# EAGLE design nedonand5 (EAGLE 5.12)
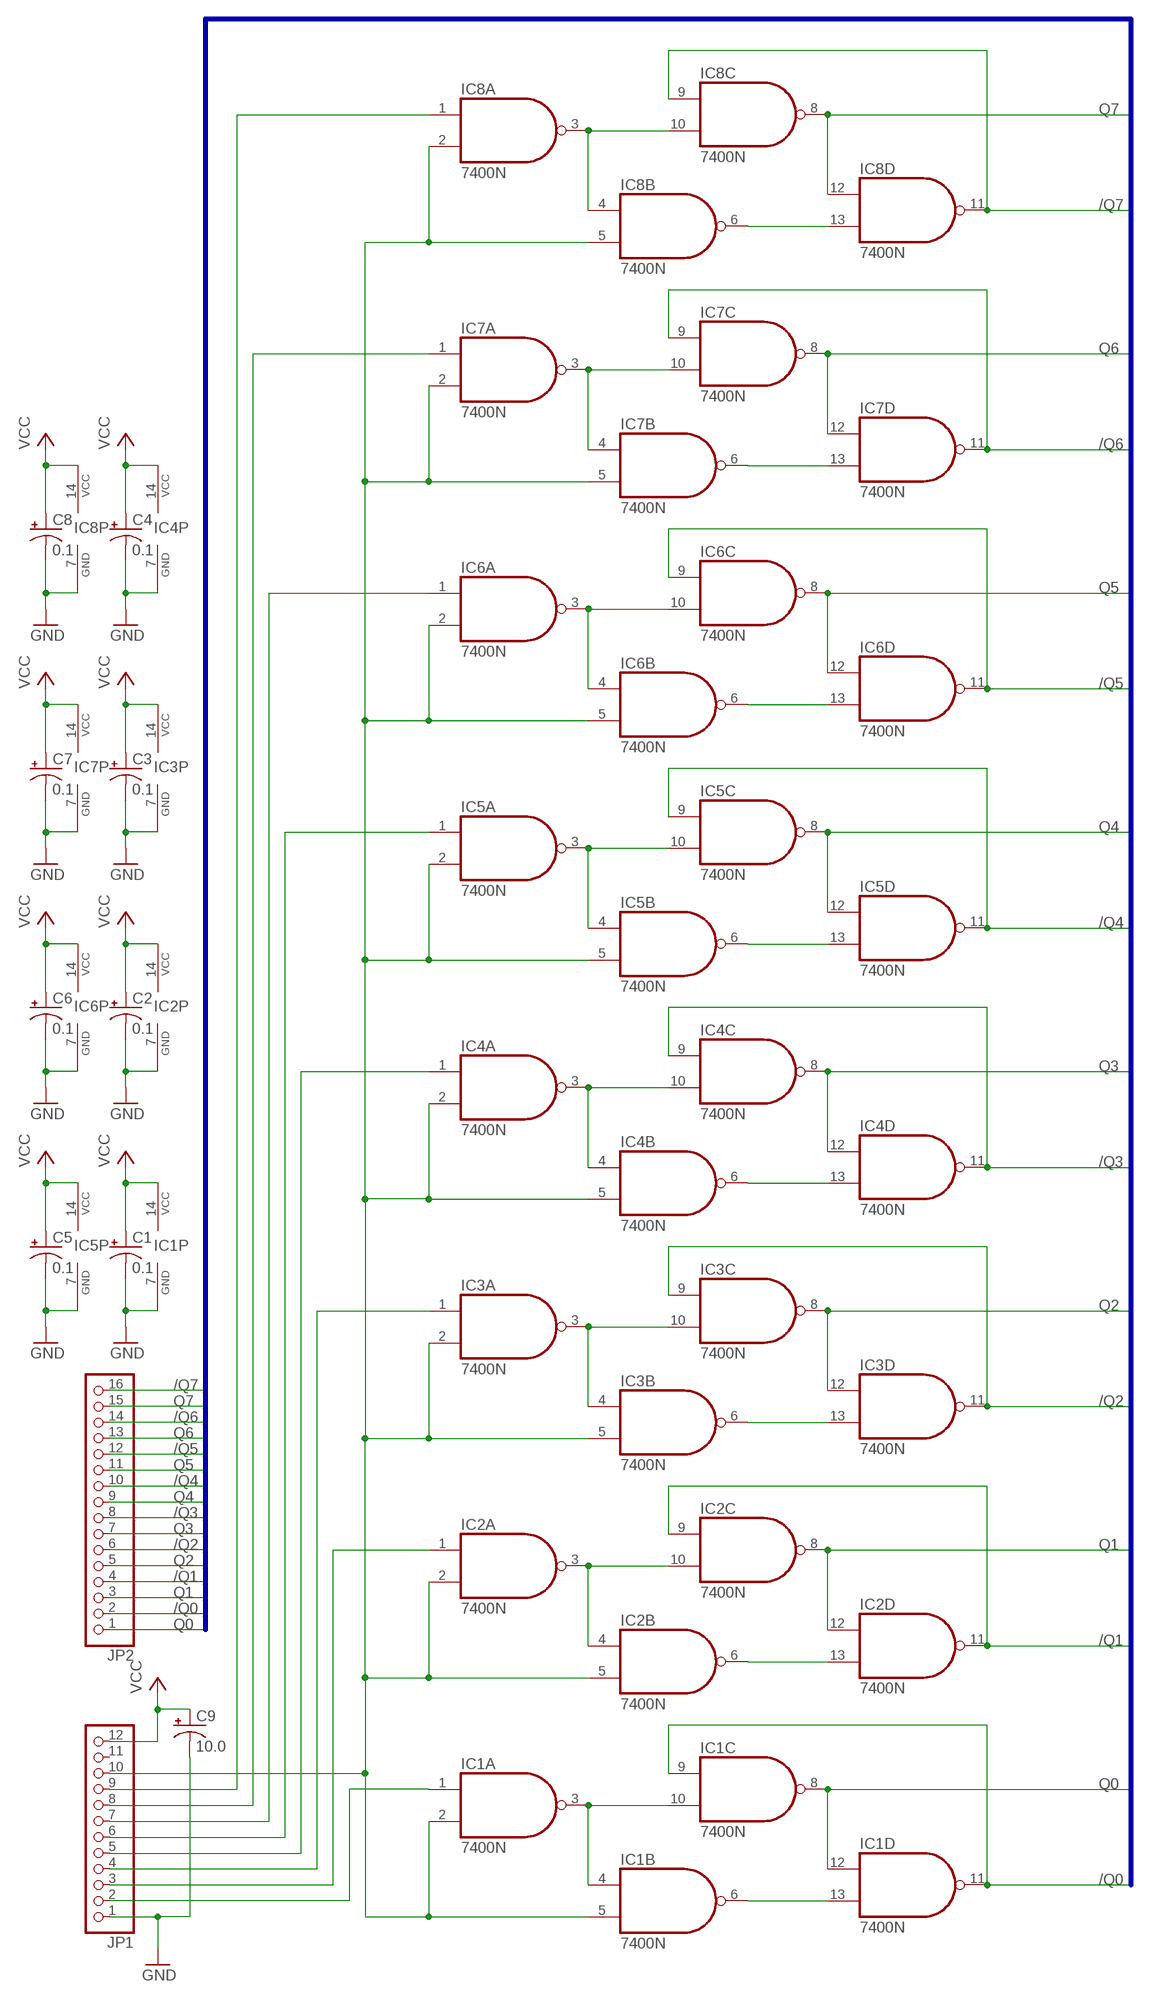
[diagram p0: schematic, sheet 1]

## Parts
C1  0.1  CPOL-USB45181A  [B45181A]
C2  0.1  CPOL-USB45181A  [B45181A]
C3  0.1  CPOL-USB45181A  [B45181A]
C4  0.1  CPOL-USB45181A  [B45181A]
C5  0.1  CPOL-USB45181A  [B45181A]
C6  0.1  CPOL-USB45181A  [B45181A]
C7  0.1  CPOL-USB45181A  [B45181A]
C8  0.1  CPOL-USB45181A  [B45181A]
C9  10.0  CPOL-USE2,5-6E  [E2,5-6E]
IC1  7400N  [DIL14]
IC2  7400N  [DIL14]
IC3  7400N  [DIL14]
IC4  7400N  [DIL14]
IC5  7400N  [DIL14]
IC6  7400N  [DIL14]
IC7  7400N  [DIL14]
IC8  7400N  [DIL14]
JP1  PINHD-1X12/90  [1X12/90]
JP2  PINHD-1X16/90  [1X16/90]

## Nets
/Q0: IC1.9(C:I0) IC1.11(D:O) JP2.2
/Q1: IC2.9(C:I0) IC2.11(D:O) JP2.4
/Q2: IC3.9(C:I0) IC3.11(D:O) JP2.6
/Q3: IC4.9(C:I0) IC4.11(D:O) JP2.8
/Q4: IC5.9(C:I0) IC5.11(D:O) JP2.10
/Q5: IC6.9(C:I0) IC6.11(D:O) JP2.12
/Q6: IC7.9(C:I0) IC7.11(D:O) JP2.14
/Q7: IC8.9(C:I0) IC8.11(D:O) JP2.16
GND: C1.- C2.- C3.- C4.- C5.- C6.- C7.- C8.- C9.- IC1.7(P:GND) IC2.7(P:GND) IC3.7(P:GND) IC4.7(P:GND) IC5.7(P:GND) IC6.7(P:GND) IC7.7(P:GND) IC8.7(P:GND) JP1.1
N$1: IC1.3(A:O) IC1.4(B:I0) IC1.10(C:I1)
N$3: IC1.1(A:I0) JP1.2
N$4: IC1.6(B:O) IC1.13(D:I1)
N$7: IC2.3(A:O) IC2.4(B:I0) IC2.10(C:I1)
N$9: IC2.1(A:I0) JP1.3
N$10: IC2.6(B:O) IC2.13(D:I1)
N$13: IC3.3(A:O) IC3.4(B:I0) IC3.10(C:I1)
N$15: IC3.1(A:I0) JP1.4
N$16: IC3.6(B:O) IC3.13(D:I1)
N$19: IC4.3(A:O) IC4.4(B:I0) IC4.10(C:I1)
N$20: IC1.2(A:I1) IC1.5(B:I1) IC2.2(A:I1) IC2.5(B:I1) IC3.2(A:I1) IC3.5(B:I1) IC4.2(A:I1) IC4.5(B:I1) IC5.2(A:I1) IC5.5(B:I1) IC6.2(A:I1) IC6.5(B:I1) IC7.2(A:I1) IC7.5(B:I1) IC8.2(A:I1) IC8.5(B:I1) JP1.10
N$21: IC4.1(A:I0) JP1.5
N$22: IC4.6(B:O) IC4.13(D:I1)
N$25: IC5.3(A:O) IC5.4(B:I0) IC5.10(C:I1)
N$28: IC5.6(B:O) IC5.13(D:I1)
N$31: IC6.3(A:O) IC6.4(B:I0) IC6.10(C:I1)
N$34: IC6.6(B:O) IC6.13(D:I1)
N$37: IC7.3(A:O) IC7.4(B:I0) IC7.10(C:I1)
N$40: IC7.6(B:O) IC7.13(D:I1)
N$43: IC8.3(A:O) IC8.4(B:I0) IC8.10(C:I1)
N$46: IC8.6(B:O) IC8.13(D:I1)
N$49: IC5.1(A:I0) JP1.6
N$50: IC6.1(A:I0) JP1.7
N$51: IC7.1(A:I0) JP1.8
N$52: IC8.1(A:I0) JP1.9
Q0: IC1.8(C:O) IC1.12(D:I0) JP2.1
Q1: IC2.8(C:O) IC2.12(D:I0) JP2.3
Q2: IC3.8(C:O) IC3.12(D:I0) JP2.5
Q3: IC4.8(C:O) IC4.12(D:I0) JP2.7
Q4: IC5.8(C:O) IC5.12(D:I0) JP2.9
Q5: IC6.8(C:O) IC6.12(D:I0) JP2.11
Q6: IC7.8(C:O) IC7.12(D:I0) JP2.13
Q7: IC8.8(C:O) IC8.12(D:I0) JP2.15
VCC: C1.+ C2.+ C3.+ C4.+ C5.+ C6.+ C7.+ C8.+ C9.+ IC1.14(P:VCC) IC2.14(P:VCC) IC3.14(P:VCC) IC4.14(P:VCC) IC5.14(P:VCC) IC6.14(P:VCC) IC7.14(P:VCC) IC8.14(P:VCC) JP1.12
Unconnected: JP1.11

## Buses
Q[0..7],/Q[0..7]

## Library data of the parts
C1-C9 = rcl:CPOL-US: POLARIZED CAPACITOR, American symbol
IC1-IC8 = 74xx-us:74*00: Quad 2-input NAND gate
JP1 = pinhead:PINHD-1X12: PIN HEADER
JP2 = pinhead:PINHD-1X16: PIN HEADER

## Board
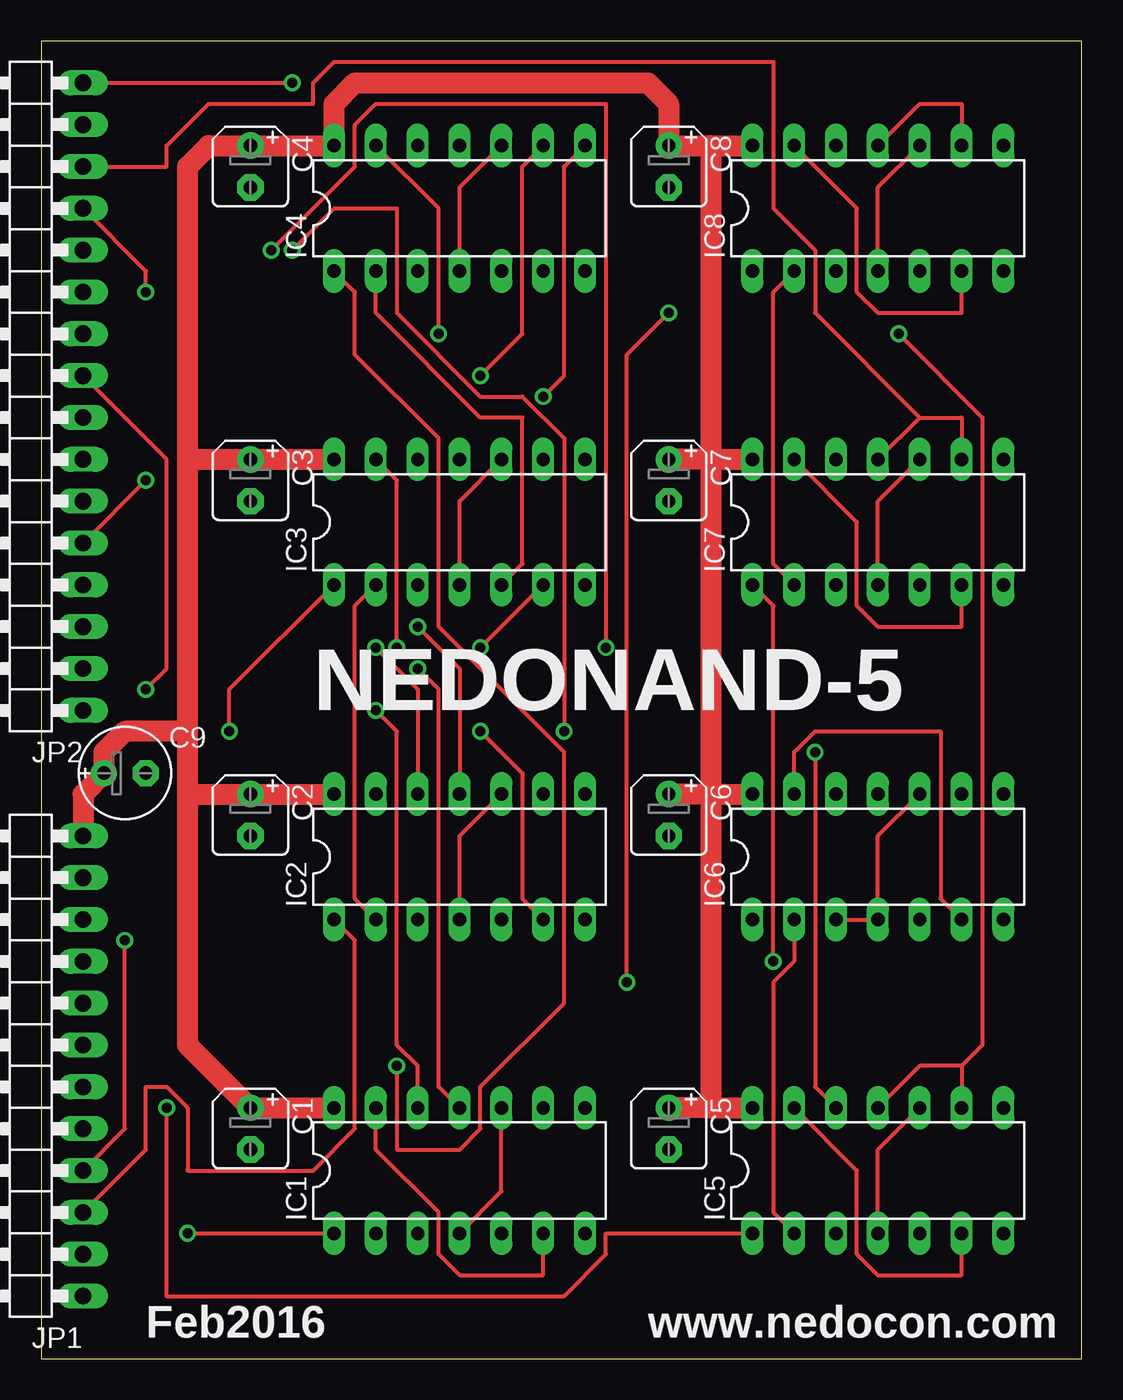
[diagram p1: board, top side]
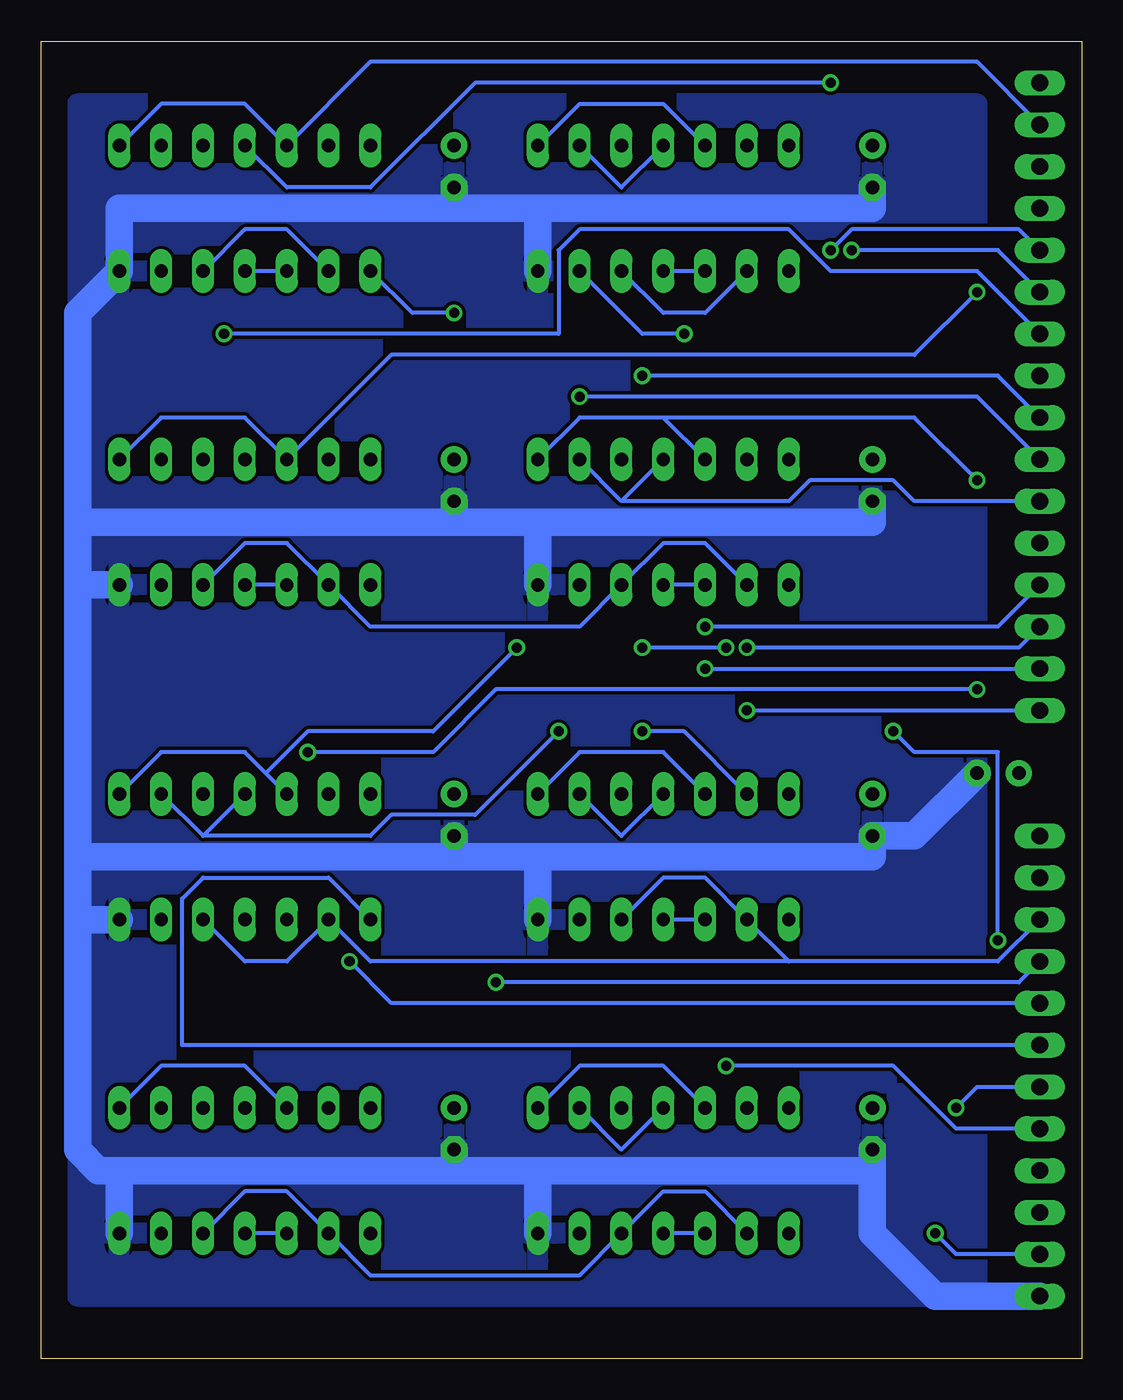
[diagram p2: board, bottom side, seen from below]

Size 63.17 x 80 mm. Coordinates in mm from the lower left corner, seen from the top.
Outline: 0,0 63.17,0 63.17,80 0,80 0,0
Copper layers (1*16): Top 0.035mm / dielectric 1.5mm / Bottom 0.035mm
Design rules "default": minimum track width 10mil, minimum drill 24mil, track to track 8mil, track to pad 8mil, pad to pad 8mil, via to via 8mil, smd to smd 8mil, copper to edge 40mil, drill to drill 8mil, minimum pad ring 10mil, minimum via ring 8mil, stop-mask expansion 4mil, vias tented up to drill 0mil, thermal gap 10mil

### Footprints (pad centres in the part's own frame; a part is rotated, then mirrored left to right if it is on the bottom)
B45181A = drill 0.813 pad 1.6 round: + -1.27,0 | drill 0.813 pad 1.6 octagon: - 1.27,0
E2,5-6E = drill 0.813 pad 1.575 round: + -1.27,0 | drill 0.813 pad 1.575 octagon: - 1.27,0
DIL14 = drill 0.813 long: 1 -7.62,-3.81; 2 -5.08,-3.81; 3 -2.54,-3.81; 4 0,-3.81; 5 2.54,-3.81; 6 5.08,-3.81; 7 7.62,-3.81; 8 7.62,3.81; 9 5.08,3.81; 10 2.54,3.81; 11 0,3.81; 12 -2.54,3.81; 13 -5.08,3.81; 14 -7.62,3.81
1X12/90 = drill 1.016 long: 1 -13.97,-3.81; 2 -11.43,-3.81; 3 -8.89,-3.81; 4 -6.35,-3.81; 5 -3.81,-3.81; 6 -1.27,-3.81; 7 1.27,-3.81; 8 3.81,-3.81; 9 6.35,-3.81; 10 8.89,-3.81; 11 11.43,-3.81; 12 13.97,-3.81
1X16/90 = drill 1.016 long: 1 -19.05,-3.81; 2 -16.51,-3.81; 3 -13.97,-3.81; 4 -11.43,-3.81; 5 -8.89,-3.81; 6 -6.35,-3.81; 7 -3.81,-3.81; 8 -1.27,-3.81; 9 1.27,-3.81; 10 3.81,-3.81; 11 6.35,-3.81; 12 8.89,-3.81; 13 11.43,-3.81; 14 13.97,-3.81; 15 16.51,-3.81; 16 19.05,-3.81

### Placement (x,y rotation side)
C1  12.7,13.97 270 top
C2  12.7,33.02 270 top
C3  12.7,53.34 270 top
C4  12.7,72.39 270 top
C5  38.1,13.97 270 top
C6  38.1,33.02 270 top
C7  38.1,53.34 270 top
C8  38.1,72.39 270 top
C9  5.08,35.56 0 top
IC1  25.4,11.43 0 top
IC2  25.4,30.48 0 top
IC3  25.4,50.8 0 top
IC4  25.4,69.85 0 top
IC5  50.8,11.43 0 top
IC6  50.8,30.48 0 top
IC7  50.8,50.8 0 top
IC8  50.8,69.85 0 top
JP1  -1.27,17.78 90 top
JP2  -1.27,58.42 90 top

### Tracks (layer width: path | path; a pad name or v marks a point on that pad's centre or on a via)
/Q0  (via drill 0.61)
  Top 0.254: v22.86,41.91 24.13,40.64 24.13,16.51 IC1.11
  Bottom 0.254: IC1.11 27.94,12.7 IC1.9 | v22.86,41.91 JP2.2
/Q1  (via drill 0.61)
  Top 0.254: v22.86,44.45 25.4,41.91 IC2.11
  Bottom 0.254: IC2.11 27.94,31.75 IC2.9 | JP2.4 5.08,44.45 v22.86,44.45
/Q2
  Bottom 0.254: 27.94,52.07 IC3.11 | 27.94,52.07 IC3.9 | JP2.6 10.16,52.07 11.43,53.34 16.51,53.34 17.78,52.07 27.94,52.07
/Q3  (via drill 0.61)
  Top 0.254: v26.67,59.69 29.21,62.23 29.21,72.39 IC4.9
  Bottom 0.254: IC4.11 27.94,71.12 IC4.9 | JP2.8 5.08,59.69 v26.67,59.69
/Q4  (via drill 0.61)
  Top 0.254: IC5.11 53.34,17.78 55.88,17.78 | 55.88,17.78 IC5.9 | v52.07,62.23 57.15,57.15 57.15,19.05 55.88,17.78
  Bottom 0.254: JP2.10 6.35,66.04 15.24,66.04 17.78,68.58 30.48,68.58 31.75,67.31 31.75,62.23 v52.07,62.23
/Q5  (via drill 0.61)
  Top 0.254: v15.24,67.31 17.78,69.85 21.59,69.85 21.59,63.5 26.67,58.42 29.21,58.42 31.75,55.88 v31.75,38.1
  Bottom 0.254: 53.34,31.75 IC6.11 | 53.34,31.75 IC6.9 | JP2.12 3.81,68.58 13.97,68.58 v15.24,67.31 | v31.75,38.1 36.83,33.02 41.91,33.02 43.18,31.75 53.34,31.75
/Q6
  Top 0.254: 53.34,57.15 IC7.11 | 53.34,57.15 55.88,57.15 IC7.9 | JP2.14 7.62,72.39 7.62,73.66 10.16,76.2 16.51,76.2 16.51,77.47 17.78,78.74 44.45,78.74 44.45,69.85 46.99,67.31 46.99,63.5 53.34,57.15
/Q7  (via drill 0.61)
  Top 0.254: IC8.11 53.34,76.2 55.88,76.2 IC8.9 | JP2.16 v15.24,77.47
  Bottom 0.254: v15.24,77.47 36.83,77.47 43.18,71.12 48.26,71.12 IC8.11
GND
  Bottom 1.676: JP1.1 8.89,3.81 12.7,7.62 12.7,11.43 | 12.7,11.43 C1.- | 33.02,11.43 IC1.7 | 12.7,11.43 33.02,11.43 | 33.02,11.43 38.1,11.43 | 38.1,11.43 58.42,11.43 | 58.42,11.43 IC5.7 | 58.42,11.43 59.69,11.43 60.96,12.7 60.96,26.67 | 60.96,26.67 60.96,30.48 | 60.96,30.48 38.1,30.48 | 38.1,30.48 33.02,30.48 | 33.02,30.48 12.7,30.48 C2.- 10.16,31.75 C9.- | 60.96,30.48 60.96,46.99 | 60.96,46.99 60.96,50.8 | 60.96,50.8 38.1,50.8 | 38.1,50.8 33.02,50.8 | 33.02,50.8 12.7,50.8 C3.- | 38.1,69.85 33.02,69.85 | 33.02,69.85 12.7,69.85 C4.- | 38.1,69.85 58.42,69.85 IC8.7 60.96,63.5 60.96,50.8 | 38.1,69.85 C8.- | 38.1,50.8 C7.- | 60.96,46.99 IC7.7 | 60.96,26.67 IC6.7 | 33.02,30.48 IC2.7 | 33.02,50.8 IC3.7 | 33.02,69.85 IC4.7 | 38.1,30.48 C6.- | 38.1,11.43 C5.-
  pour Bottom: 6.35,76.2 60.96,76.2 60.96,3.81 6.35,3.81
N$1
  Top 0.254: IC1.10 27.94,10.16 IC1.4
  Bottom 0.254: IC1.3 IC1.4
N$3  (via drill 0.61)
  Top 0.254: v8.89,7.62 IC1.1
  Bottom 0.254: v8.89,7.62 7.62,6.35 JP1.2
N$4
  Top 0.254: IC1.13 20.32,12.7 24.13,8.89 24.13,6.35 25.4,5.08 30.48,5.08 IC1.6
N$7
  Top 0.254: IC2.10 25.4,31.75 IC2.4
  Bottom 0.254: IC2.3 IC2.4
N$9
  Top 0.254: IC2.1 19.05,25.4 19.05,13.97 16.51,11.43 8.89,11.43 8.89,15.24 7.62,16.51 6.35,16.51 6.35,12.7 JP1.3
N$10  (via drill 0.61)
  Top 0.254: v26.67,38.1 29.21,35.56 29.21,27.94 IC2.6
  Bottom 0.254: IC2.13 24.13,38.1 v26.67,38.1
N$13
  Top 0.254: IC3.10 25.4,52.07 IC3.4
  Bottom 0.254: IC3.3 IC3.4
N$15  (via drill 0.61)
  Top 0.254: IC3.1 11.43,40.64 v11.43,38.1 | v5.08,25.4 5.08,13.97 JP1.4
  Bottom 0.254: v11.43,38.1 10.16,36.83 5.08,36.83 v5.08,25.4
N$16  (via drill 0.61)
  Top 0.254: IC3.13 21.59,53.34 v21.59,43.18 | v26.67,43.18 IC3.6
  Bottom 0.254: v21.59,43.18 v26.67,43.18
N$19
  Top 0.254: IC4.10 25.4,71.12 IC4.4
  Bottom 0.254: IC4.3 IC4.4
N$20
  Top 0.254: IC4.2 20.32,63.5 26.67,57.15 29.21,57.15 29.21,48.26 IC3.5 | IC8.2 44.45,64.77 44.45,48.26 IC7.2 | IC5.2 44.45,8.89 44.45,22.86 45.72,24.13 IC6.2 | IC3.2 19.05,45.72 19.05,27.94 IC2.2
  Bottom 0.254: IC8.2 48.26,68.58 50.8,68.58 IC8.5 | IC4.2 22.86,63.5 25.4,63.5 IC4.5 | IC3.2 22.86,49.53 25.4,49.53 IC3.5 30.48,44.45 43.18,44.45 IC7.2 48.26,49.53 50.8,49.53 IC7.5 | IC1.2 22.86,10.16 25.4,10.16 IC1.5 30.48,5.08 43.18,5.08 IC5.2 48.26,10.16 50.8,10.16 IC5.5 | IC6.5 50.8,24.13 48.26,24.13 IC6.2 43.18,24.13 17.78,24.13 | IC2.5 25.4,29.21 22.86,29.21 IC2.2 17.78,24.13 | JP1.10 5.08,24.13 17.78,24.13
N$21  (via drill 0.61)
  Top 0.254: IC4.1 19.05,64.77 19.05,60.96 24.13,55.88 24.13,44.45 31.75,36.83 31.75,21.59 26.67,16.51 26.67,13.97 25.4,12.7 21.59,12.7 v21.59,17.78
  Bottom 0.254: v21.59,17.78 11.43,17.78 7.62,13.97 JP1.5
N$22  (via drill 0.61)
  Top 0.254: IC4.13 24.13,69.85 v24.13,62.23
  Bottom 0.254: v24.13,62.23 26.67,62.23 IC4.6
N$25
  Top 0.254: IC5.10 50.8,12.7 IC5.4
  Bottom 0.254: IC5.3 IC5.4
N$28
  Top 0.254: IC5.13 49.53,11.43 49.53,6.35 50.8,5.08 55.88,5.08 IC5.6
N$31
  Top 0.254: IC6.3 IC6.4 50.8,31.75 IC6.10
N$34
  Top 0.254: IC6.13 45.72,36.83 46.99,38.1 54.61,38.1 54.61,27.94 IC6.6
N$37
  Top 0.254: IC7.10 50.8,52.07 IC7.4
  Bottom 0.254: IC7.3 IC7.4
N$40
  Top 0.254: IC7.13 49.53,50.8 49.53,45.72 50.8,44.45 55.88,44.45 IC7.6
N$43
  Top 0.254: IC8.10 50.8,71.12 IC8.4
  Bottom 0.254: IC8.3 IC8.4
N$46
  Top 0.254: IC8.13 49.53,69.85 49.53,64.77 50.8,63.5 55.88,63.5 IC8.6
N$49  (via drill 0.61)
  Top 0.254: IC5.1 34.29,7.62 34.29,6.35 31.75,3.81 7.62,3.81 v7.62,15.24
  Bottom 0.254: v7.62,15.24 6.35,16.51 JP1.6
N$50
  Bottom 0.254: IC6.1 45.72,29.21 53.34,29.21 54.61,27.94 54.61,19.05 JP1.7
N$51  (via drill 0.61)
  Top 0.254: IC7.1 44.45,45.72 v44.45,24.13
  Bottom 0.254: v44.45,24.13 41.91,21.59 JP1.8
N$52  (via drill 0.61)
  Top 0.254: v38.1,63.5 35.56,60.96 v35.56,22.86
  Bottom 0.254: IC8.1 40.64,63.5 v38.1,63.5 | v35.56,22.86 3.81,22.86 JP1.9
Q0  (via drill 0.61)
  Top 0.254: v20.32,39.37 21.59,38.1 21.59,19.05 22.86,17.78 IC1.12
  Bottom 0.254: IC1.12 25.4,17.78 30.48,17.78 IC1.8 | v20.32,39.37 JP2.1
Q1  (via drill 0.61)
  Top 0.254: v20.32,43.18 22.86,40.64 IC2.12
  Bottom 0.254: IC2.12 25.4,36.83 30.48,36.83 IC2.8 | JP2.3 3.81,43.18 v20.32,43.18
Q2  (via drill 0.61)
  Top 0.254: JP2.5 v6.35,53.34
  Bottom 0.254: 25.4,57.15 IC3.12 | 25.4,57.15 30.48,57.15 IC3.8 | v6.35,53.34 10.16,57.15 25.4,57.15
Q3  (via drill 0.61)
  Top 0.254: v30.48,58.42 31.75,59.69 31.75,72.39 IC4.8
  Bottom 0.254: IC4.12 25.4,76.2 30.48,76.2 IC4.8 | JP2.7 6.35,58.42 v30.48,58.42
Q4  (via drill 0.61)
  Top 0.254: JP2.9 7.62,54.61 7.62,41.91 v6.35,40.64 | v46.99,36.83 46.99,16.51 IC5.12
  Bottom 0.254: IC5.12 50.8,17.78 55.88,17.78 IC5.8 | v6.35,40.64 35.56,40.64 39.37,36.83 v46.99,36.83
Q5  (via drill 0.61)
  Top 0.254: v13.97,67.31 19.05,72.39 19.05,74.93 20.32,76.2 34.29,76.2 v34.29,43.18
  Bottom 0.254: 49.53,35.56 50.8,36.83 55.88,36.83 IC6.8 | 49.53,35.56 IC6.12 | JP2.11 5.08,67.31 v13.97,67.31 | v34.29,43.18 39.37,38.1 46.99,38.1 49.53,35.56
Q6  (via drill 0.61)
  Top 0.254: JP2.13 6.35,66.04 v6.35,64.77
  Bottom 0.254: IC7.8 55.88,57.15 50.8,57.15 IC7.12 41.91,60.96 10.16,60.96 v6.35,64.77
Q7
  Bottom 0.254: IC8.8 55.88,76.2 50.8,76.2 IC8.12 43.18,78.74 6.35,78.74 JP2.15
VCC
  Top 1.27: JP1.12 2.54,34.29 C9.+ 3.81,36.83 5.08,38.1 8.89,38.1 | 8.89,34.29 8.89,19.05 C1.+ IC1.14 | 8.89,34.29 8.89,38.1 | 8.89,38.1 8.89,54.61 | 8.89,54.61 8.89,72.39 10.16,73.66 C4.+ IC4.14 17.78,76.2 19.05,77.47 36.83,77.47 38.1,76.2 C8.+ 40.64,73.66 | 40.64,54.61 C7.+ | IC3.14 C3.+ 8.89,54.61 | 8.89,34.29 C2.+ IC2.14 | 40.64,34.29 C6.+ | 40.64,34.29 IC6.14 | 40.64,15.24 C5.+ | 40.64,15.24 IC5.14 | 40.64,34.29 40.64,15.24 | 40.64,54.61 IC7.14 | 40.64,54.61 40.64,34.29 | 40.64,73.66 IC8.14 | 40.64,73.66 40.64,54.61

### Text on the board
tNames: NEDONAND-5 | Feb2016 | www.nedocon.com